# EAGLE schematic contra4218_config (EAGLE 7.5.0)
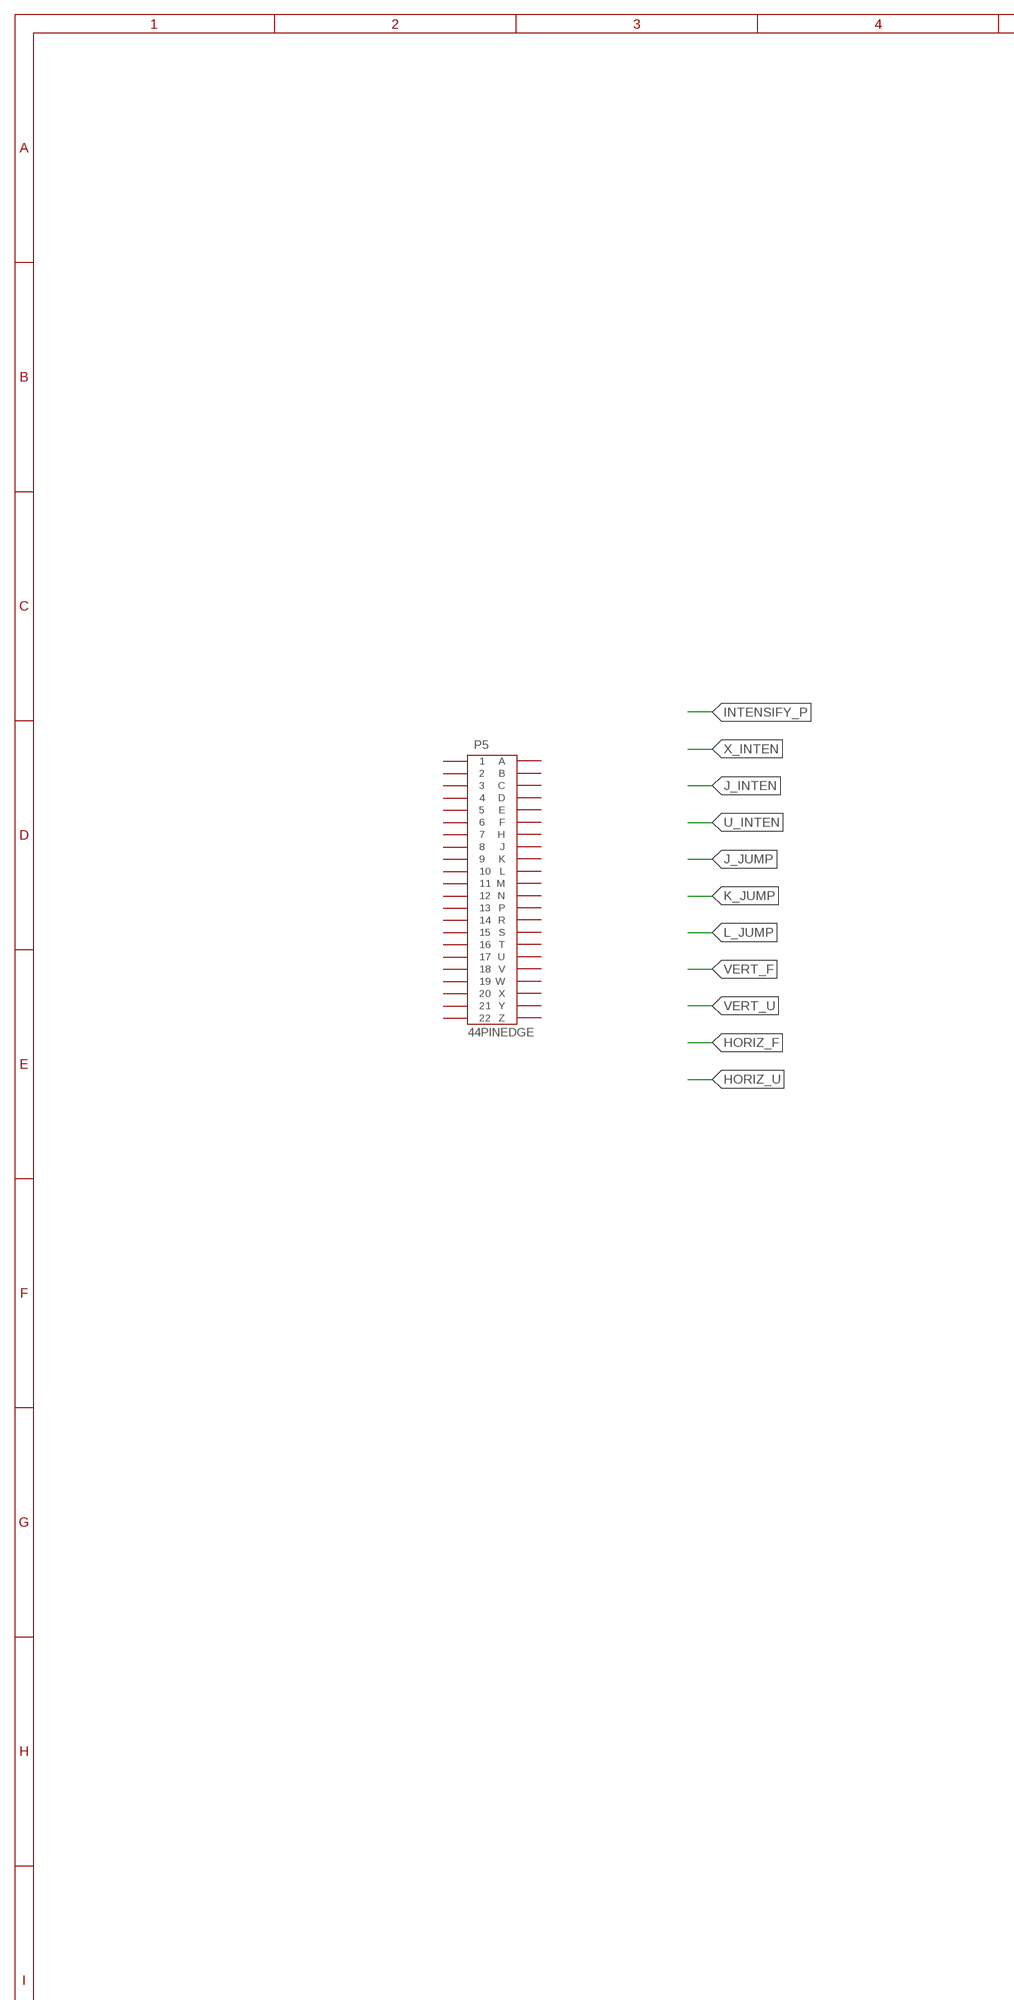
[diagram p0: schematic, sheet 1, part 1 of 2]
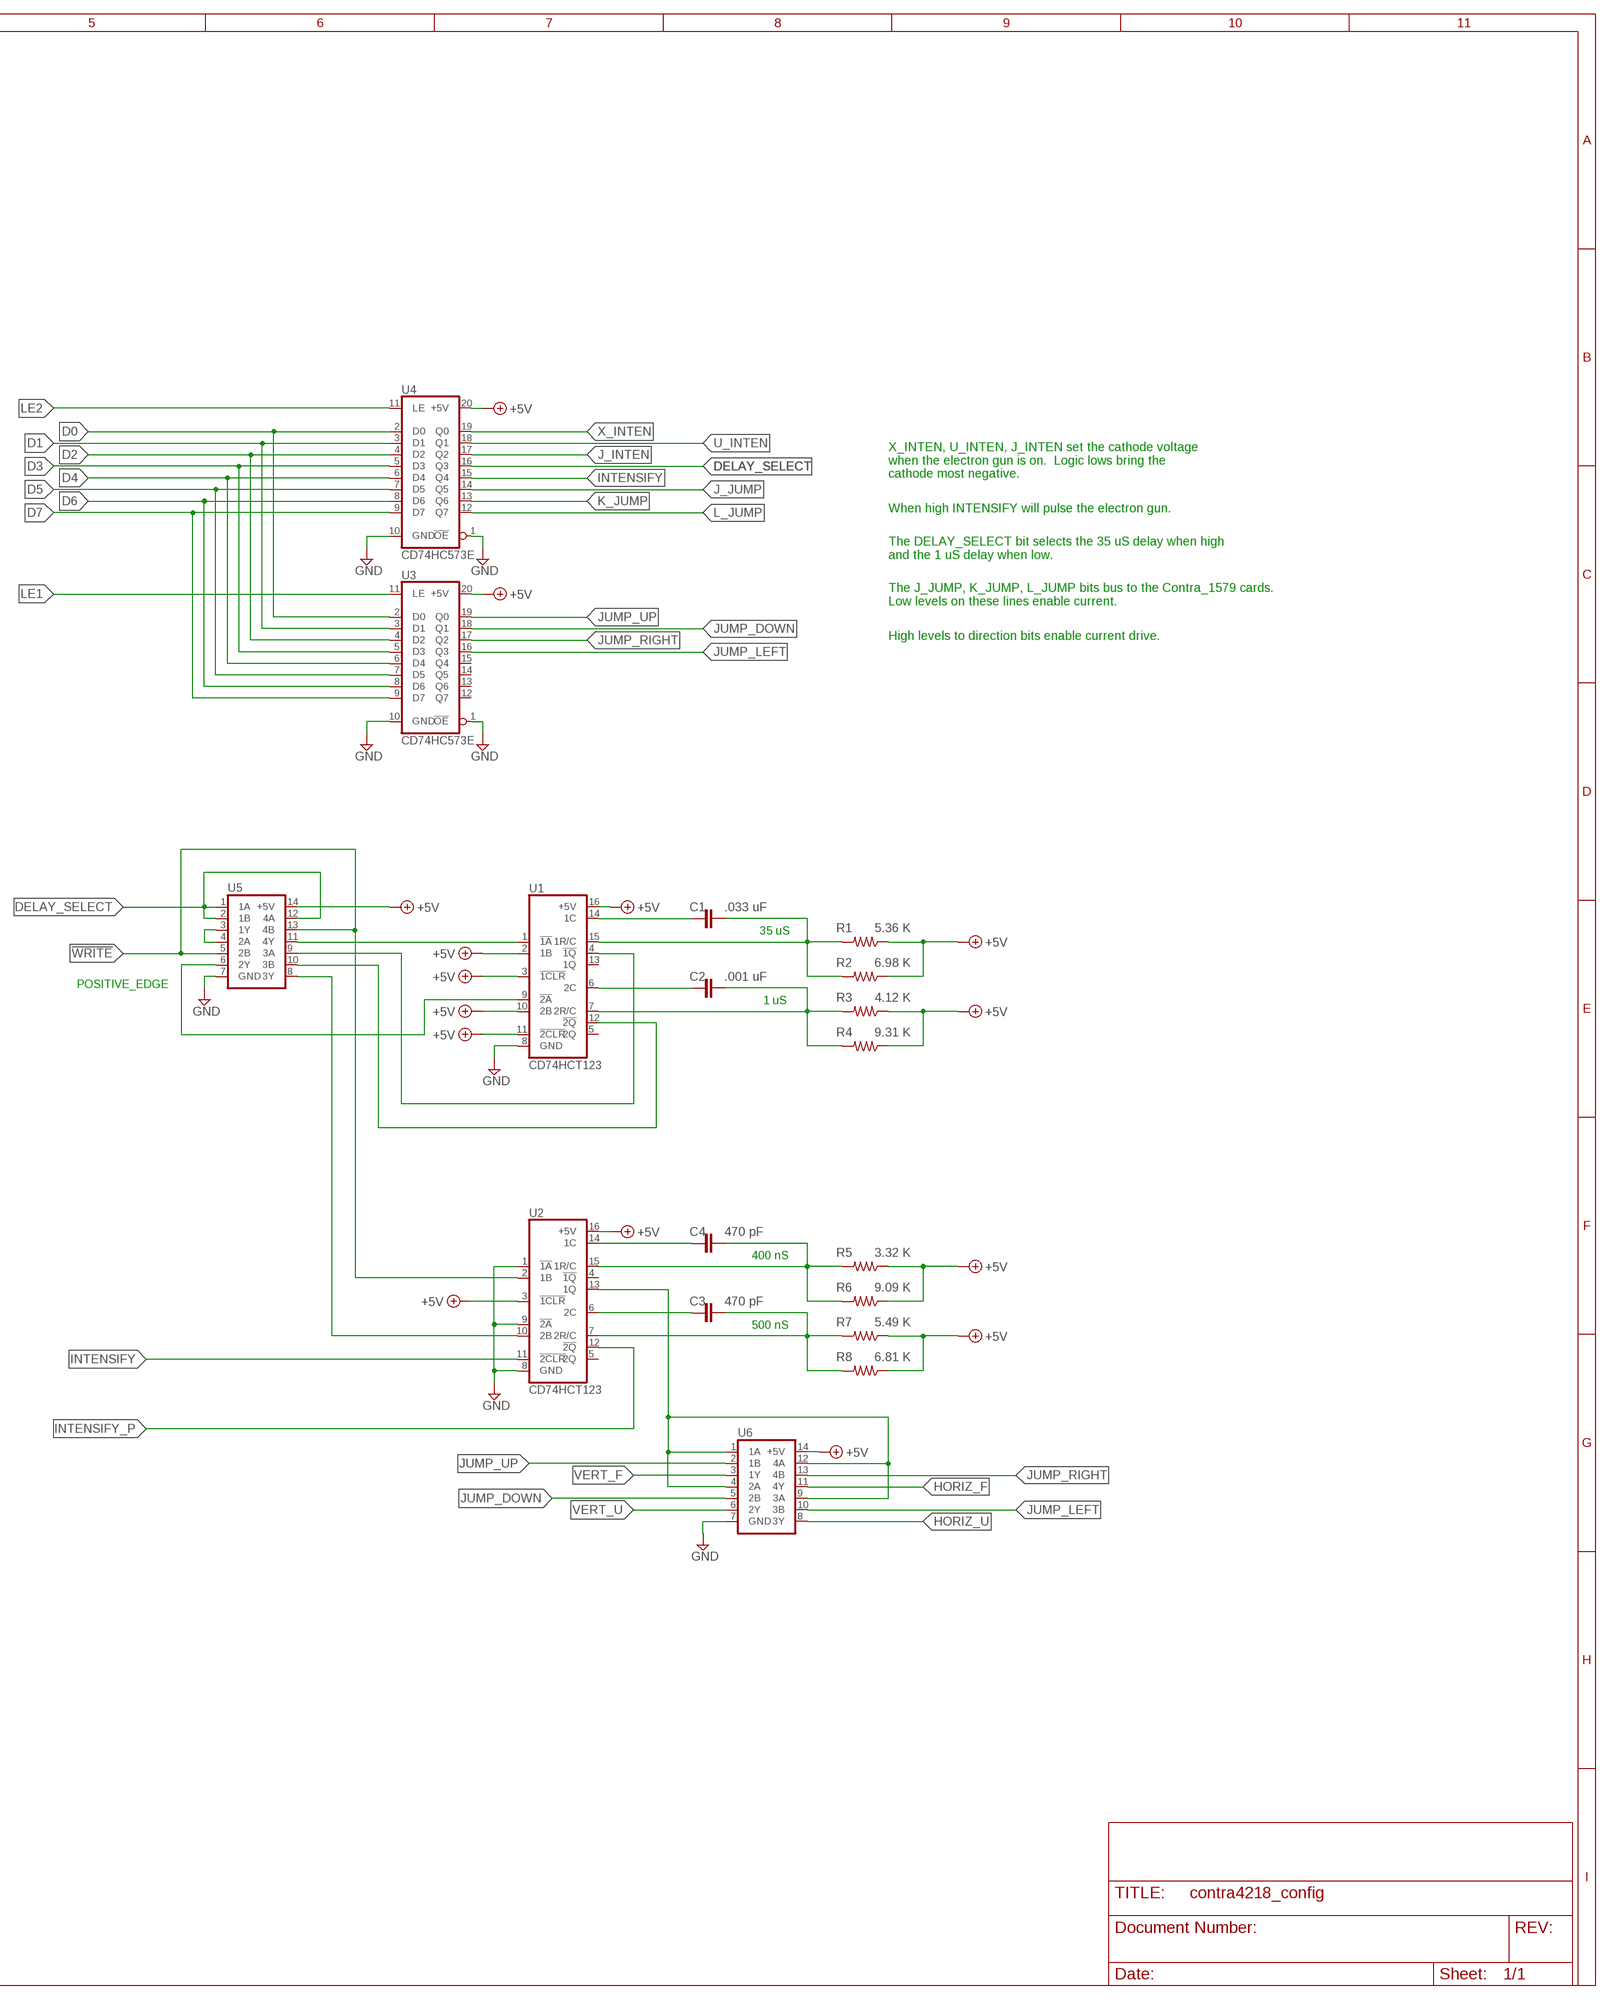
[diagram p1: schematic, sheet 1, part 2 of 2]

## Parts
C1  .033 uF  CAP_5MM  [5MM_TH]
C2  .001 uF  CAP_5MM  [5MM_TH]
C3  470 pF  CAP_5MM  [5MM_TH]
C4  470 pF  CAP_5MM  [5MM_TH]
P5  44PINEDGE  [44PINEDGE]
R1  5.36 K  R-1/4WATT  [0207/10]
R2  6.98 K  R-1/4WATT  [0207/10]
R3  4.12 K  R-1/4WATT  [0207/10]
R4  9.31 K  R-1/4WATT  [0207/10]
R5  3.32 K  R-1/4WATT  [0207/10]
R6  9.09 K  R-1/4WATT  [0207/10]
R7  5.49 K  R-1/4WATT  [0207/10]
R8  6.81 K  R-1/4WATT  [0207/10]
U1  CD74HCT123  [DIP-16]
U2  CD74HCT123  [DIP-16]
U3  CD74HC573E  [DIP-20]
U4  CD74HC573E  [DIP-20]
U5  CD74HC00  [DIP-14]
U6  CD74HC00  [DIP-14]

## Nets
!WRITE: U2.2(1B) U5.5(2B) U5.13(4B)
+5V: R1.1 R2.1 R3.1 R4.1 R5.1 R6.1 R7.1 R8.1 U1.2(1B) U1.3(!1CLR) U1.10(2B) U1.11(!2CLR) U1.16(+5V) U2.3(!1CLR) U2.16(+5V) U3.20(+5V) U4.20(+5V) U5.14(+5V) U6.14(+5V)
D0: U3.2(D0) U4.2(D0)
D1: U3.3(D1) U4.3(D1)
D2: U3.4(D2) U4.4(D2)
D3: U3.5(D3) U4.5(D3)
D4: U3.6(D4) U4.6(D4)
D5: U3.7(D5) U4.7(D5)
D6: U3.8(D6) U4.8(D6)
D7: U3.9(D7) U4.9(D7)
DELAY_SELECT: U4.16(Q3) U5.1(1A) U5.2(1B) U5.12(4A)
GND: U1.8(GND) U2.1(!1A) U2.8(GND) U2.9(!2A) U3.1(!OE) U3.10(GND) U4.1(!OE) U4.10(GND) U5.7(GND) U6.7(GND)
HORIZ_F: U6.11(4Y)
HORIZ_U: U6.8(3Y)
INTENSIFY: U2.11(!2CLR) U4.15(Q4)
INTENSIFY_P: U2.12(!2Q)
J_INTEN: U4.17(Q2)
J_JUMP: U4.14(Q5)
JUMP_DOWN: U3.18(Q1)
JUMP_LEFT: U3.16(Q3)
JUMP_RIGHT: U3.17(Q2)
JUMP_UP: U3.19(Q0)
K_JUMP: U4.13(Q6)
L_JUMP: U4.12(Q7)
LE1: U3.11(LE)
LE2: U4.11(LE)
N$1: C1.1 U1.14(1C)
N$2: C1.2 R1.2 R2.2 U1.15(1R/C)
N$3: C2.1 U1.6(2C)
N$4: C2.2 R3.2 R4.2 U1.7(2R/C)
N$5: C4.1 U2.14(1C)
N$6: C3.2 R7.2 R8.2 U2.7(2R/C)
N$7: C3.1 U2.6(2C)
N$8: C4.2 R5.2 R6.2 U2.15(1R/C)
N$9: U1.1(!1A) U5.11(4Y)
N$10: U5.3(1Y) U5.4(2A)
N$11: U2.13(1Q) U6.1(1A) U6.4(2A) U6.9(3A) U6.12(4A)
N$12: U1.9(!2A) U5.6(2Y)
N$13: U1.4(!1Q) U5.9(3A)
N$14: U1.12(!2Q) U5.10(3B)
N$15: U2.10(2B) U5.8(3Y)
U_INTEN: U4.18(Q1)
VERT_F: U6.3(1Y)
VERT_U: U6.6(2Y)
X_INTEN: U4.19(Q0)
Unconnected: P5.1 P5.2 P5.3 P5.4 P5.5 P5.6 P5.7 P5.8 P5.9 P5.10 P5.11 P5.12 P5.13 P5.14 P5.15 P5.16 P5.17 P5.18 P5.19 P5.20 P5.21 P5.22 P5.A P5.B P5.C P5.D P5.E P5.F P5.H P5.J P5.K P5.L P5.M P5.N P5.P P5.R P5.S P5.T P5.U P5.V P5.W P5.X P5.Y P5.Z U1.5(2Q) U1.13(1Q) U2.4(!1Q) U2.5(2Q) U3.12(Q7) U3.13(Q6) U3.14(Q5) U3.15(Q4) U6.2(1B) U6.5(2B) U6.10(3B) U6.13(4B)

## Notes on the sheet
- X_INTEN, U_INTEN, J_INTEN set the cathode voltage 
  when the electron gun is on.  Logic lows bring the 
  cathode most negative.
- When high INTENSIFY will pulse the electron gun.
- The DELAY_SELECT bit selects the 35 uS delay when high 
  and the 1 uS delay when low.
- The J_JUMP, K_JUMP, L_JUMP bits bus to the Contra_1579 cards.  
  Low levels on these lines enable current.
- High levels to direction bits enable current drive.
- 35 uS
- POSITIVE_EDGE
- 1 uS
- 400 nS
- 500 nS

## Library data of the parts
C1-C4 = keiths:CAP_5MM: Through hole radial, 5m pin spacing.
P5 = keiths:44PINEDGE: 44 PIN EDGE CONNECTOR FOR PCB
R1-R8 = keiths:R-1/4WATT: Quarter watt through hole resistor.
U1 U2 = keiths:CD74HCT123: High-Speed CMOS Logic Dual Retriggerable Monostable Multivibrator
U3 U4 = keiths:CD74HC573E: Octal Transparent D-Type Latches With 3-State Outputs
U5 U6 = keiths:CD74HC00: Quad 2-Input NAND Gate